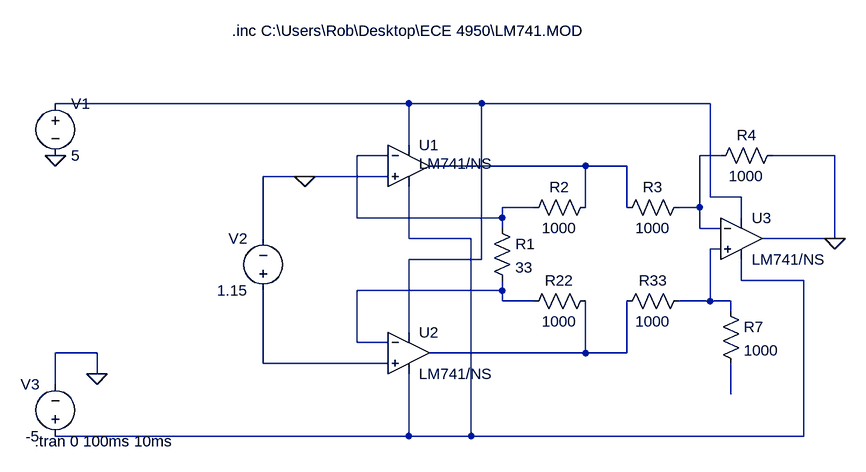
[diagram p0: schematic Instr_Amp.asc]
Instr_Amp.asc, the LTspice schematic file:
Version 4
SHEET 1 880 680
WIRE -32 -64 -576 -64
WIRE 80 -64 -32 -64
WIRE 432 -64 80 -64
WIRE -32 0 -32 -64
WIRE -64 16 -112 16
WIRE 448 16 416 16
WIRE 624 16 528 16
WIRE 240 32 0 32
WIRE 304 32 240 32
WIRE -192 48 -256 48
WIRE -64 48 -192 48
WIRE 432 80 432 -64
WIRE 480 80 432 80
WIRE 160 96 112 96
WIRE 240 96 240 32
WIRE 304 96 304 32
WIRE 416 96 416 16
WIRE 416 96 384 96
WIRE -112 112 -112 16
WIRE 112 112 112 96
WIRE 112 112 -112 112
WIRE 480 112 480 80
WIRE 112 128 112 112
WIRE 416 128 416 96
WIRE 448 128 416 128
WIRE -256 144 -256 48
WIRE -32 144 -32 64
WIRE 64 144 -32 144
WIRE 624 144 624 16
WIRE 624 144 512 144
WIRE 448 160 432 160
WIRE 80 176 80 -64
WIRE 80 176 -32 176
WIRE 480 208 480 176
WIRE 576 208 480 208
WIRE 112 224 112 208
WIRE 112 224 -112 224
WIRE 112 240 112 224
WIRE 160 240 112 240
WIRE 432 240 432 160
WIRE 432 240 384 240
WIRE 464 240 432 240
WIRE 464 256 464 240
WIRE -32 288 -32 176
WIRE -112 304 -112 224
WIRE -64 304 -112 304
WIRE -512 320 -576 320
WIRE 240 320 240 240
WIRE 240 320 0 320
WIRE 304 320 304 240
WIRE 304 320 240 320
WIRE -256 336 -256 224
WIRE -64 336 -256 336
WIRE -512 352 -512 320
WIRE -576 368 -576 320
WIRE 464 384 464 336
WIRE -32 448 -32 352
WIRE -32 448 -576 448
WIRE 64 448 64 144
WIRE 64 448 -32 448
WIRE 576 448 576 208
WIRE 576 448 64 448
FLAG -576 16 0
FLAG -512 352 0
FLAG -192 48 0
FLAG 624 144 0
SYMBOL res 96 112 R0
SYMATTR InstName R1
SYMATTR Value 33
SYMBOL Opamps\\opamp2 -32 -32 R0
WINDOW 3 16 60 Left 2
SYMATTR Value LM741/NS
SYMATTR InstName U1
SYMBOL Opamps\\opamp2 -32 256 R0
SYMATTR InstName U2
SYMATTR Value LM741/NS
SYMBOL Opamps\\opamp2 480 80 R0
SYMATTR InstName U3
SYMATTR Value LM741/NS
SYMBOL res 256 80 R90
WINDOW 0 0 56 VBottom 2
WINDOW 3 32 56 VTop 2
SYMATTR InstName R2
SYMATTR Value 1000
SYMBOL res 400 80 R90
WINDOW 0 0 56 VBottom 2
WINDOW 3 32 56 VTop 2
SYMATTR InstName R3
SYMATTR Value 1000
SYMBOL res 400 224 R90
WINDOW 0 0 56 VBottom 2
WINDOW 3 32 56 VTop 2
SYMATTR InstName R33
SYMATTR Value 1000
SYMBOL res 544 0 R90
WINDOW 0 0 56 VBottom 2
WINDOW 3 32 56 VTop 2
SYMATTR InstName R4
SYMATTR Value 1000
SYMBOL res 448 240 R0
SYMATTR InstName R7
SYMATTR Value 1000
SYMBOL res 256 224 R90
WINDOW 0 0 56 VBottom 2
WINDOW 3 32 56 VTop 2
SYMATTR InstName R22
SYMATTR Value 1000
SYMBOL voltage -256 240 R180
WINDOW 0 24 96 Left 2
WINDOW 3 24 16 Left 2
SYMATTR InstName V2
SYMATTR Value 1.15
SYMBOL voltage -576 -80 R0
SYMATTR InstName V1
SYMATTR Value 5
SYMBOL voltage -576 464 R180
WINDOW 0 24 96 Left 2
WINDOW 3 24 16 Left 2
SYMATTR InstName V3
SYMATTR Value -5
TEXT -304 -176 Left 2 !.inc C:\\Users\\Rob\\Desktop\\ECE 4950\\LM741.MOD
TEXT -608 456 Left 2 !.tran 0 100ms 10ms

The netlist it stands for:
* Instr_Amp.asc
R1 N002 N007 33
XU1 0 N002 N001 N005 N004 LM741/NS  ; pins In+ In- V+ V- OUT
XU2 N009 N007 N001 N005 N008 LM741/NS  ; pins In+ In- V+ V- OUT
XU3 N006 N003 N001 N005 0 LM741/NS  ; pins In+ In- V+ V- OUT
R2 N004 N002 1000
R3 N003 N004 1000
R33 N006 N008 1000
R4 0 N003 1000
R7 N006 N010 1000
R22 N008 N007 1000
V2 N009 0 1.15
V1 N001 0 5
V3 N005 0 -5
.inc C:\Users\Rob\Desktop\ECE 4950\LM741.MOD
.tran 0 100ms 10ms
.backanno
.end